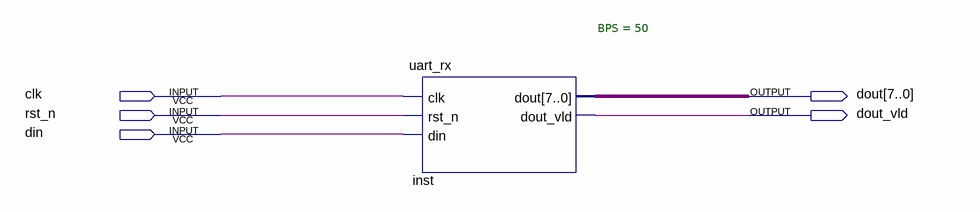
[diagram p0: schematic sheet]
// Quartus schematic uart_rx_tst.bdf as structural Verilog: 1 symbols, 5 pins
module uart_rx_tst (
  input  clk,
  input  rst_n,
  input  din,
  output [7:0] dout,
  output dout_vld
);

  uart_rx #(.BPS(50)) inst (.clk(clk), .rst_n(rst_n), .din(din), .dout(dout), .dout_vld(dout_vld));
endmodule
